# EAGLE design ChromDot_Ring_five_inch (EAGLE 9.1.0)
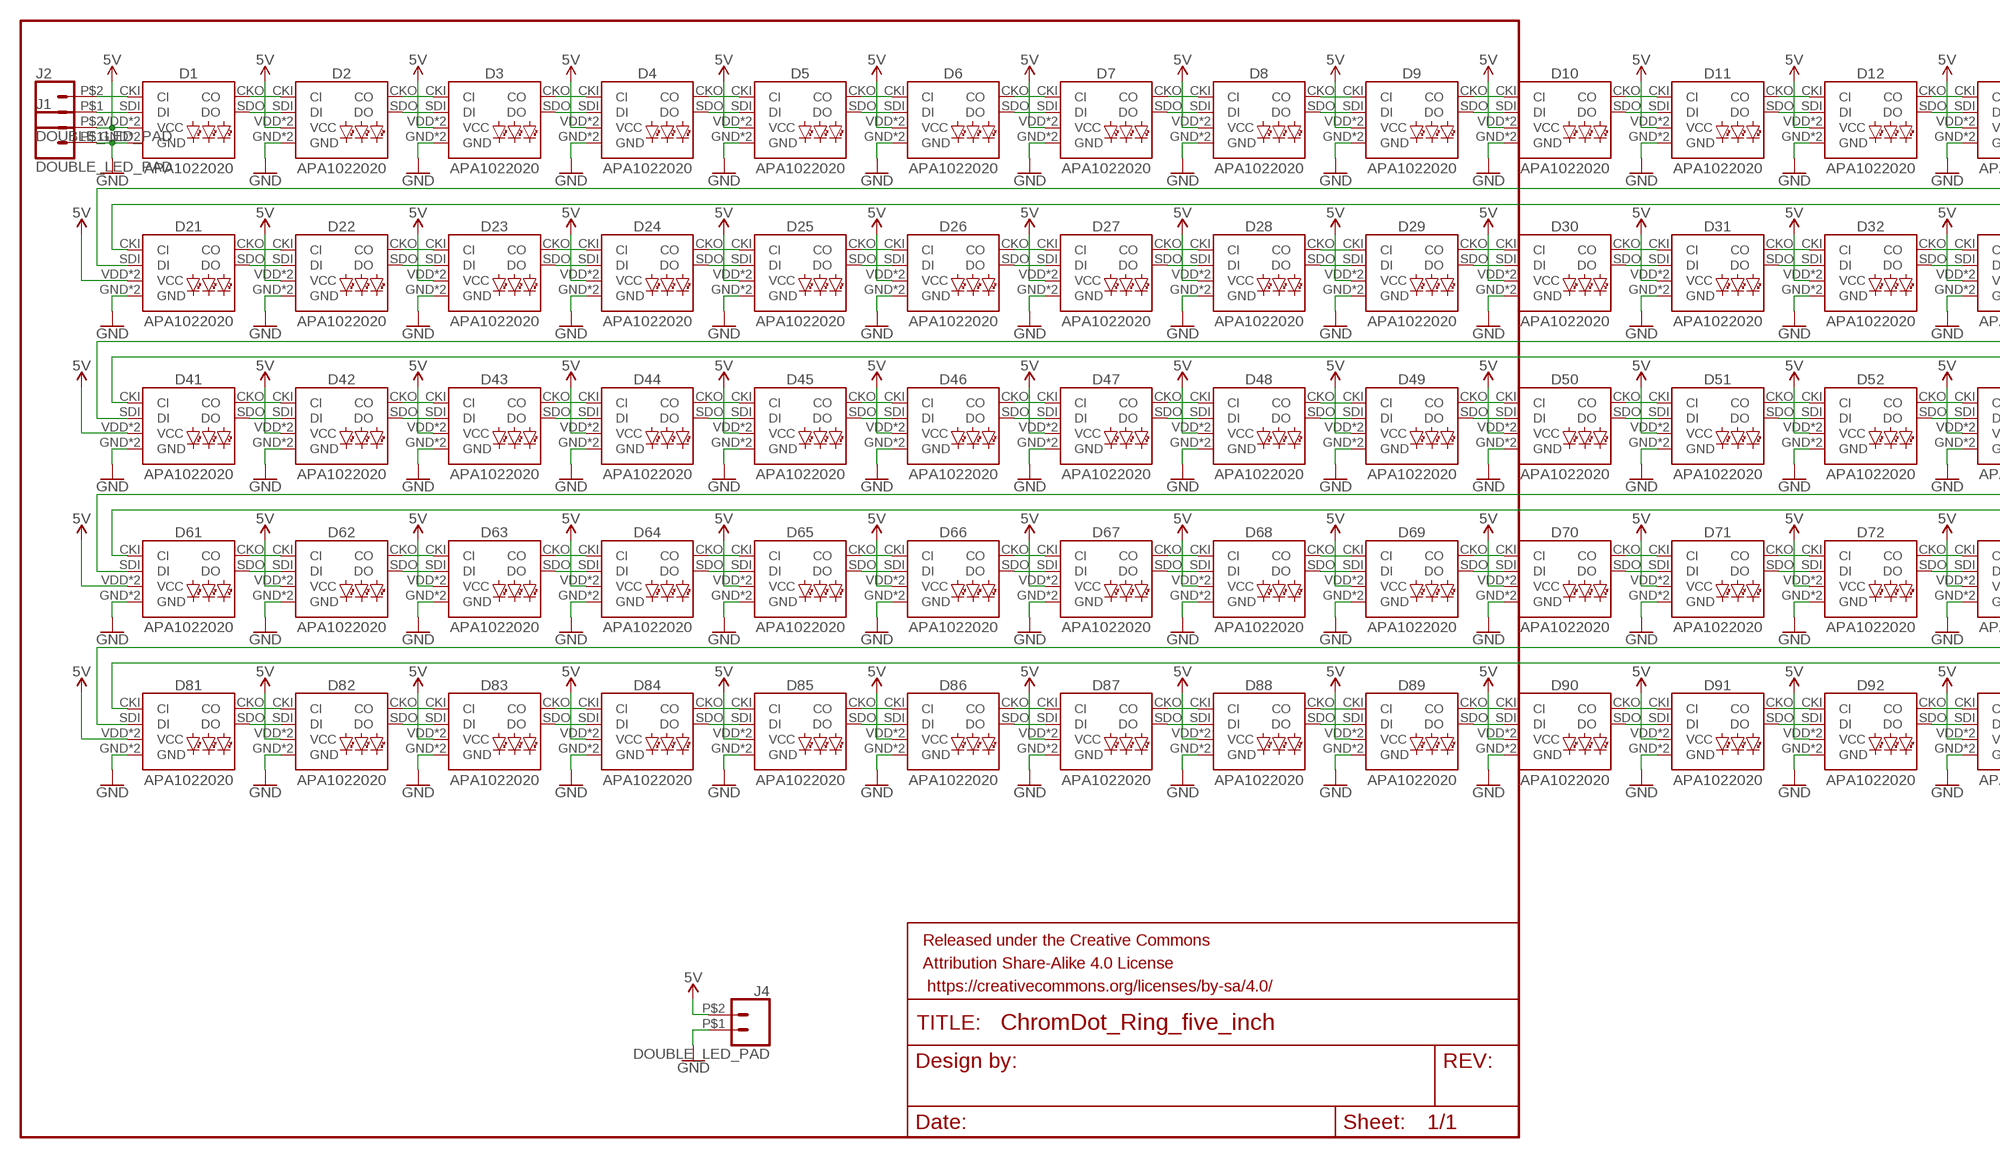
[diagram p0: schematic, sheet 1, part 1 of 2]
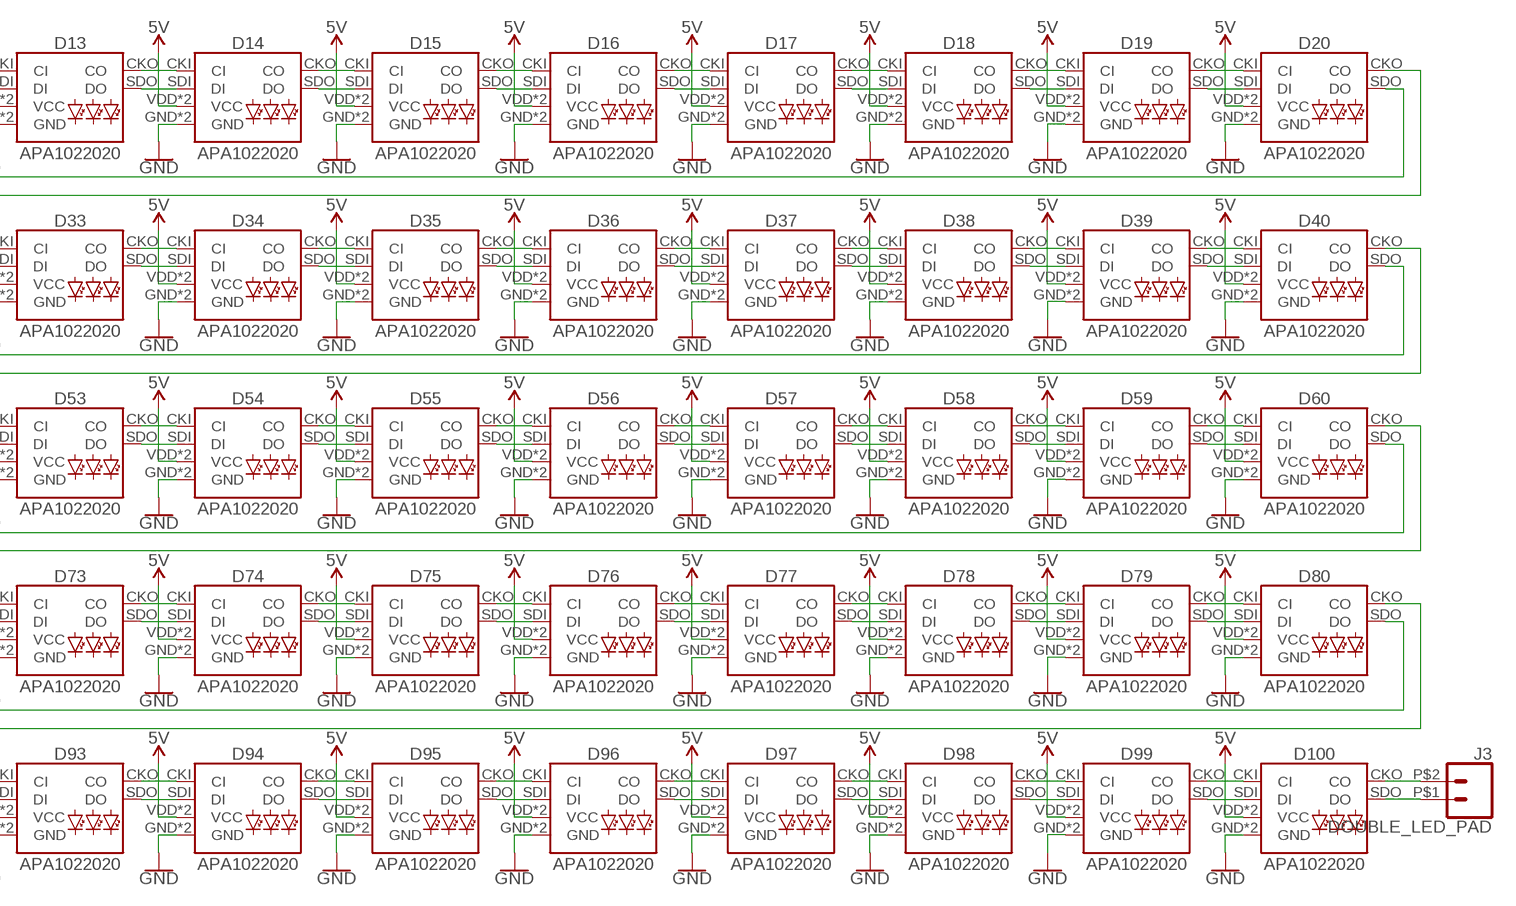
[diagram p1: schematic, sheet 1, part 2 of 2]

## Parts
D1  APA1022020  [APA102-2020]
D2  APA1022020  [APA102-2020]
D3  APA1022020  [APA102-2020]
D4  APA1022020  [APA102-2020]
D5  APA1022020  [APA102-2020]
D6  APA1022020  [APA102-2020]
D7  APA1022020  [APA102-2020]
D8  APA1022020  [APA102-2020]
D9  APA1022020  [APA102-2020]
D10  APA1022020  [APA102-2020]
D11  APA1022020  [APA102-2020]
D12  APA1022020  [APA102-2020]
D13  APA1022020  [APA102-2020]
D14  APA1022020  [APA102-2020]
D15  APA1022020  [APA102-2020]
D16  APA1022020  [APA102-2020]
D17  APA1022020  [APA102-2020]
D18  APA1022020  [APA102-2020]
D19  APA1022020  [APA102-2020]
D20  APA1022020  [APA102-2020]
D21  APA1022020  [APA102-2020]
D22  APA1022020  [APA102-2020]
D23  APA1022020  [APA102-2020]
D24  APA1022020  [APA102-2020]
D25  APA1022020  [APA102-2020]
D26  APA1022020  [APA102-2020]
D27  APA1022020  [APA102-2020]
D28  APA1022020  [APA102-2020]
D29  APA1022020  [APA102-2020]
D30  APA1022020  [APA102-2020]
D31  APA1022020  [APA102-2020]
D32  APA1022020  [APA102-2020]
D33  APA1022020  [APA102-2020]
D34  APA1022020  [APA102-2020]
D35  APA1022020  [APA102-2020]
D36  APA1022020  [APA102-2020]
D37  APA1022020  [APA102-2020]
D38  APA1022020  [APA102-2020]
D39  APA1022020  [APA102-2020]
D40  APA1022020  [APA102-2020]
D41  APA1022020  [APA102-2020]
D42  APA1022020  [APA102-2020]
D43  APA1022020  [APA102-2020]
D44  APA1022020  [APA102-2020]
D45  APA1022020  [APA102-2020]
D46  APA1022020  [APA102-2020]
D47  APA1022020  [APA102-2020]
D48  APA1022020  [APA102-2020]
D49  APA1022020  [APA102-2020]
D50  APA1022020  [APA102-2020]
D51  APA1022020  [APA102-2020]
D52  APA1022020  [APA102-2020]
D53  APA1022020  [APA102-2020]
D54  APA1022020  [APA102-2020]
D55  APA1022020  [APA102-2020]
D56  APA1022020  [APA102-2020]
D57  APA1022020  [APA102-2020]
D58  APA1022020  [APA102-2020]
D59  APA1022020  [APA102-2020]
D60  APA1022020  [APA102-2020]
D61  APA1022020  [APA102-2020]
D62  APA1022020  [APA102-2020]
D63  APA1022020  [APA102-2020]
D64  APA1022020  [APA102-2020]
D65  APA1022020  [APA102-2020]
D66  APA1022020  [APA102-2020]
D67  APA1022020  [APA102-2020]
D68  APA1022020  [APA102-2020]
D69  APA1022020  [APA102-2020]
D70  APA1022020  [APA102-2020]
D71  APA1022020  [APA102-2020]
D72  APA1022020  [APA102-2020]
D73  APA1022020  [APA102-2020]
D74  APA1022020  [APA102-2020]
D75  APA1022020  [APA102-2020]
D76  APA1022020  [APA102-2020]
D77  APA1022020  [APA102-2020]
D78  APA1022020  [APA102-2020]
D79  APA1022020  [APA102-2020]
D80  APA1022020  [APA102-2020]
D81  APA1022020  [APA102-2020]
D82  APA1022020  [APA102-2020]
D83  APA1022020  [APA102-2020]
D84  APA1022020  [APA102-2020]
D85  APA1022020  [APA102-2020]
D86  APA1022020  [APA102-2020]
D87  APA1022020  [APA102-2020]
D88  APA1022020  [APA102-2020]
D89  APA1022020  [APA102-2020]
D90  APA1022020  [APA102-2020]
D91  APA1022020  [APA102-2020]
D92  APA1022020  [APA102-2020]
D93  APA1022020  [APA102-2020]
D94  APA1022020  [APA102-2020]
D95  APA1022020  [APA102-2020]
D96  APA1022020  [APA102-2020]
D97  APA1022020  [APA102-2020]
D98  APA1022020  [APA102-2020]
D99  APA1022020  [APA102-2020]
D100  APA1022020  [APA102-2020]
FRAME1  FRAME-LETTER  [CREATIVE_COMMONS]
J1  DOUBLE_LED_PAD  [DOUBLELEDPAD]
J2  DOUBLE_LED_PAD  [DOUBLELEDPAD]
J3  DOUBLE_LED_PAD  [DOUBLELEDPAD]
J4  DOUBLE_LED_PAD  [DOUBLELEDPAD]

## Nets
5V: D1.VDD(VCC) D1.VDDPAD(VCC) D2.VDD(VCC) D2.VDDPAD(VCC) D3.VDD(VCC) D3.VDDPAD(VCC) D4.VDD(VCC) D4.VDDPAD(VCC) D5.VDD(VCC) D5.VDDPAD(VCC) D6.VDD(VCC) D6.VDDPAD(VCC) D7.VDD(VCC) D7.VDDPAD(VCC) D8.VDD(VCC) D8.VDDPAD(VCC) D9.VDD(VCC) D9.VDDPAD(VCC) D10.VDD(VCC) D10.VDDPAD(VCC) D11.VDD(VCC) D11.VDDPAD(VCC) D12.VDD(VCC) D12.VDDPAD(VCC) D13.VDD(VCC) D13.VDDPAD(VCC) D14.VDD(VCC) D14.VDDPAD(VCC) D15.VDD(VCC) D15.VDDPAD(VCC) D16.VDD(VCC) D16.VDDPAD(VCC) D17.VDD(VCC) D17.VDDPAD(VCC) D18.VDD(VCC) D18.VDDPAD(VCC) D19.VDD(VCC) D19.VDDPAD(VCC) D20.VDD(VCC) D20.VDDPAD(VCC) D21.VDD(VCC) D21.VDDPAD(VCC) D22.VDD(VCC) D22.VDDPAD(VCC) D23.VDD(VCC) D23.VDDPAD(VCC) D24.VDD(VCC) D24.VDDPAD(VCC) D25.VDD(VCC) D25.VDDPAD(VCC) D26.VDD(VCC) D26.VDDPAD(VCC) D27.VDD(VCC) D27.VDDPAD(VCC) D28.VDD(VCC) D28.VDDPAD(VCC) D29.VDD(VCC) D29.VDDPAD(VCC) D30.VDD(VCC) D30.VDDPAD(VCC) D31.VDD(VCC) D31.VDDPAD(VCC) D32.VDD(VCC) D32.VDDPAD(VCC) D33.VDD(VCC) D33.VDDPAD(VCC) D34.VDD(VCC) D34.VDDPAD(VCC) D35.VDD(VCC) D35.VDDPAD(VCC) D36.VDD(VCC) D36.VDDPAD(VCC) D37.VDD(VCC) D37.VDDPAD(VCC) D38.VDD(VCC) D38.VDDPAD(VCC) D39.VDD(VCC) D39.VDDPAD(VCC) D40.VDD(VCC) D40.VDDPAD(VCC) D41.VDD(VCC) D41.VDDPAD(VCC) D42.VDD(VCC) D42.VDDPAD(VCC) D43.VDD(VCC) D43.VDDPAD(VCC) D44.VDD(VCC) D44.VDDPAD(VCC) D45.VDD(VCC) D45.VDDPAD(VCC) D46.VDD(VCC) D46.VDDPAD(VCC) D47.VDD(VCC) D47.VDDPAD(VCC) D48.VDD(VCC) D48.VDDPAD(VCC) D49.VDD(VCC) D49.VDDPAD(VCC) D50.VDD(VCC) D50.VDDPAD(VCC) D51.VDD(VCC) D51.VDDPAD(VCC) D52.VDD(VCC) D52.VDDPAD(VCC) D53.VDD(VCC) D53.VDDPAD(VCC) D54.VDD(VCC) D54.VDDPAD(VCC) D55.VDD(VCC) D55.VDDPAD(VCC) D56.VDD(VCC) D56.VDDPAD(VCC) D57.VDD(VCC) D57.VDDPAD(VCC) D58.VDD(VCC) D58.VDDPAD(VCC) D59.VDD(VCC) D59.VDDPAD(VCC) D60.VDD(VCC) D60.VDDPAD(VCC) D61.VDD(VCC) D61.VDDPAD(VCC) D62.VDD(VCC) D62.VDDPAD(VCC) D63.VDD(VCC) D63.VDDPAD(VCC) D64.VDD(VCC) D64.VDDPAD(VCC) D65.VDD(VCC) D65.VDDPAD(VCC) D66.VDD(VCC) D66.VDDPAD(VCC) D67.VDD(VCC) D67.VDDPAD(VCC) D68.VDD(VCC) D68.VDDPAD(VCC) D69.VDD(VCC) D69.VDDPAD(VCC) D70.VDD(VCC) D70.VDDPAD(VCC) D71.VDD(VCC) D71.VDDPAD(VCC) D72.VDD(VCC) D72.VDDPAD(VCC) D73.VDD(VCC) D73.VDDPAD(VCC) D74.VDD(VCC) D74.VDDPAD(VCC) D75.VDD(VCC) D75.VDDPAD(VCC) D76.VDD(VCC) D76.VDDPAD(VCC) D77.VDD(VCC) D77.VDDPAD(VCC) D78.VDD(VCC) D78.VDDPAD(VCC) D79.VDD(VCC) D79.VDDPAD(VCC) D80.VDD(VCC) D80.VDDPAD(VCC) D81.VDD(VCC) D81.VDDPAD(VCC) D82.VDD(VCC) D82.VDDPAD(VCC) D83.VDD(VCC) D83.VDDPAD(VCC) D84.VDD(VCC) D84.VDDPAD(VCC) D85.VDD(VCC) D85.VDDPAD(VCC) D86.VDD(VCC) D86.VDDPAD(VCC) D87.VDD(VCC) D87.VDDPAD(VCC) D88.VDD(VCC) D88.VDDPAD(VCC) D89.VDD(VCC) D89.VDDPAD(VCC) D90.VDD(VCC) D90.VDDPAD(VCC) D91.VDD(VCC) D91.VDDPAD(VCC) D92.VDD(VCC) D92.VDDPAD(VCC) D93.VDD(VCC) D93.VDDPAD(VCC) D94.VDD(VCC) D94.VDDPAD(VCC) D95.VDD(VCC) D95.VDDPAD(VCC) D96.VDD(VCC) D96.VDDPAD(VCC) D97.VDD(VCC) D97.VDDPAD(VCC) D98.VDD(VCC) D98.VDDPAD(VCC) D99.VDD(VCC) D99.VDDPAD(VCC) D100.VDD(VCC) D100.VDDPAD(VCC) J1.P$2 J4.P$2
GND: D1.GND D1.GNDPAD(GND) D2.GND D2.GNDPAD(GND) D3.GND D3.GNDPAD(GND) D4.GND D4.GNDPAD(GND) D5.GND D5.GNDPAD(GND) D6.GND D6.GNDPAD(GND) D7.GND D7.GNDPAD(GND) D8.GND D8.GNDPAD(GND) D9.GND D9.GNDPAD(GND) D10.GND D10.GNDPAD(GND) D11.GND D11.GNDPAD(GND) D12.GND D12.GNDPAD(GND) D13.GND D13.GNDPAD(GND) D14.GND D14.GNDPAD(GND) D15.GND D15.GNDPAD(GND) D16.GND D16.GNDPAD(GND) D17.GND D17.GNDPAD(GND) D18.GND D18.GNDPAD(GND) D19.GND D19.GNDPAD(GND) D20.GND D20.GNDPAD(GND) D21.GND D21.GNDPAD(GND) D22.GND D22.GNDPAD(GND) D23.GND D23.GNDPAD(GND) D24.GND D24.GNDPAD(GND) D25.GND D25.GNDPAD(GND) D26.GND D26.GNDPAD(GND) D27.GND D27.GNDPAD(GND) D28.GND D28.GNDPAD(GND) D29.GND D29.GNDPAD(GND) D30.GND D30.GNDPAD(GND) D31.GND D31.GNDPAD(GND) D32.GND D32.GNDPAD(GND) D33.GND D33.GNDPAD(GND) D34.GND D34.GNDPAD(GND) D35.GND D35.GNDPAD(GND) D36.GND D36.GNDPAD(GND) D37.GND D37.GNDPAD(GND) D38.GND D38.GNDPAD(GND) D39.GND D39.GNDPAD(GND) D40.GND D40.GNDPAD(GND) D41.GND D41.GNDPAD(GND) D42.GND D42.GNDPAD(GND) D43.GND D43.GNDPAD(GND) D44.GND D44.GNDPAD(GND) D45.GND D45.GNDPAD(GND) D46.GND D46.GNDPAD(GND) D47.GND D47.GNDPAD(GND) D48.GND D48.GNDPAD(GND) D49.GND D49.GNDPAD(GND) D50.GND D50.GNDPAD(GND) D51.GND D51.GNDPAD(GND) D52.GND D52.GNDPAD(GND) D53.GND D53.GNDPAD(GND) D54.GND D54.GNDPAD(GND) D55.GND D55.GNDPAD(GND) D56.GND D56.GNDPAD(GND) D57.GND D57.GNDPAD(GND) D58.GND D58.GNDPAD(GND) D59.GND D59.GNDPAD(GND) D60.GND D60.GNDPAD(GND) D61.GND D61.GNDPAD(GND) D62.GND D62.GNDPAD(GND) D63.GND D63.GNDPAD(GND) D64.GND D64.GNDPAD(GND) D65.GND D65.GNDPAD(GND) D66.GND D66.GNDPAD(GND) D67.GND D67.GNDPAD(GND) D68.GND D68.GNDPAD(GND) D69.GND D69.GNDPAD(GND) D70.GND D70.GNDPAD(GND) D71.GND D71.GNDPAD(GND) D72.GND D72.GNDPAD(GND) D73.GND D73.GNDPAD(GND) D74.GND D74.GNDPAD(GND) D75.GND D75.GNDPAD(GND) D76.GND D76.GNDPAD(GND) D77.GND D77.GNDPAD(GND) D78.GND D78.GNDPAD(GND) D79.GND D79.GNDPAD(GND) D80.GND D80.GNDPAD(GND) D81.GND D81.GNDPAD(GND) D82.GND D82.GNDPAD(GND) D83.GND D83.GNDPAD(GND) D84.GND D84.GNDPAD(GND) D85.GND D85.GNDPAD(GND) D86.GND D86.GNDPAD(GND) D87.GND D87.GNDPAD(GND) D88.GND D88.GNDPAD(GND) D89.GND D89.GNDPAD(GND) D90.GND D90.GNDPAD(GND) D91.GND D91.GNDPAD(GND) D92.GND D92.GNDPAD(GND) D93.GND D93.GNDPAD(GND) D94.GND D94.GNDPAD(GND) D95.GND D95.GNDPAD(GND) D96.GND D96.GNDPAD(GND) D97.GND D97.GNDPAD(GND) D98.GND D98.GNDPAD(GND) D99.GND D99.GNDPAD(GND) D100.GND D100.GNDPAD(GND) J1.P$1 J4.P$1
N$1: D4.CKO(CO) D5.CKI(CI)
N$2: D1.CKI(CI) J2.P$2
N$3: D1.SDI(DI) J2.P$1
N$4: D1.CKO(CO) D2.CKI(CI)
N$5: D1.SDO(DO) D2.SDI(DI)
N$6: D2.CKO(CO) D3.CKI(CI)
N$7: D2.SDO(DO) D3.SDI(DI)
N$8: D3.CKO(CO) D4.CKI(CI)
N$9: D3.SDO(DO) D4.SDI(DI)
N$10: D4.SDO(DO) D5.SDI(DI)
N$11: D5.CKO(CO) D6.CKI(CI)
N$12: D5.SDO(DO) D6.SDI(DI)
N$13: D6.CKO(CO) D7.CKI(CI)
N$14: D6.SDO(DO) D7.SDI(DI)
N$15: D7.CKO(CO) D8.CKI(CI)
N$16: D7.SDO(DO) D8.SDI(DI)
N$17: D16.SDO(DO) D17.SDI(DI)
N$18: D80.CKO(CO) D81.CKI(CI)
N$19: D9.CKO(CO) D10.CKI(CI)
N$20: D9.SDO(DO) D10.SDI(DI)
N$21: D10.CKO(CO) D11.CKI(CI)
N$22: D10.SDO(DO) D11.SDI(DI)
N$23: D11.CKO(CO) D12.CKI(CI)
N$24: D11.SDO(DO) D12.SDI(DI)
N$25: D12.CKO(CO) D13.CKI(CI)
N$26: D12.SDO(DO) D13.SDI(DI)
N$27: D13.CKO(CO) D14.CKI(CI)
N$28: D13.SDO(DO) D14.SDI(DI)
N$29: D14.CKO(CO) D15.CKI(CI)
N$30: D14.SDO(DO) D15.SDI(DI)
N$31: D15.CKO(CO) D16.CKI(CI)
N$32: D15.SDO(DO) D16.SDI(DI)
N$33: D8.CKO(CO) D9.CKI(CI)
N$34: D8.SDO(DO) D9.SDI(DI)
N$35: D17.CKO(CO) D18.CKI(CI)
N$36: D17.SDO(DO) D18.SDI(DI)
N$37: D18.CKO(CO) D19.CKI(CI)
N$38: D18.SDO(DO) D19.SDI(DI)
N$39: D19.CKO(CO) D20.CKI(CI)
N$40: D19.SDO(DO) D20.SDI(DI)
N$41: D20.CKO(CO) D21.CKI(CI)
N$42: D20.SDO(DO) D21.SDI(DI)
N$43: D16.CKO(CO) D17.CKI(CI)
N$44: D21.CKO(CO) D22.CKI(CI)
N$45: D21.SDO(DO) D22.SDI(DI)
N$46: D22.CKO(CO) D23.CKI(CI)
N$47: D22.SDO(DO) D23.SDI(DI)
N$48: D23.CKO(CO) D24.CKI(CI)
N$49: D23.SDO(DO) D24.SDI(DI)
N$50: D24.CKO(CO) D25.CKI(CI)
N$51: D24.SDO(DO) D25.SDI(DI)
N$52: D25.CKO(CO) D26.CKI(CI)
N$53: D25.SDO(DO) D26.SDI(DI)
N$54: D26.CKO(CO) D27.CKI(CI)
N$55: D26.SDO(DO) D27.SDI(DI)
N$56: D27.CKO(CO) D28.CKI(CI)
N$57: D27.SDO(DO) D28.SDI(DI)
N$58: D29.CKO(CO) D30.CKI(CI)
N$59: D29.SDO(DO) D30.SDI(DI)
N$60: D30.CKO(CO) D31.CKI(CI)
N$61: D30.SDO(DO) D31.SDI(DI)
N$62: D31.CKO(CO) D32.CKI(CI)
N$63: D31.SDO(DO) D32.SDI(DI)
N$64: D32.CKO(CO) D33.CKI(CI)
N$65: D32.SDO(DO) D33.SDI(DI)
N$66: D33.CKO(CO) D34.CKI(CI)
N$67: D33.SDO(DO) D34.SDI(DI)
N$68: D34.CKO(CO) D35.CKI(CI)
N$69: D34.SDO(DO) D35.SDI(DI)
N$70: D35.CKO(CO) D36.CKI(CI)
N$71: D35.SDO(DO) D36.SDI(DI)
N$72: D37.CKO(CO) D38.CKI(CI)
N$73: D37.SDO(DO) D38.SDI(DI)
N$74: D38.SDO(DO) D39.SDI(DI)
N$75: D39.CKO(CO) D40.CKI(CI)
N$76: D39.SDO(DO) D40.SDI(DI)
N$77: D38.CKO(CO) D39.CKI(CI)
N$78: D28.CKO(CO) D29.CKI(CI)
N$79: D28.SDO(DO) D29.SDI(DI)
N$80: D36.SDO(DO) D37.SDI(DI)
N$81: D36.CKO(CO) D37.CKI(CI)
N$82: D40.CKO(CO) D41.CKI(CI)
N$83: D40.SDO(DO) D41.SDI(DI)
N$84: D41.CKO(CO) D42.CKI(CI)
N$85: D41.SDO(DO) D42.SDI(DI)
N$86: D42.CKO(CO) D43.CKI(CI)
N$87: D42.SDO(DO) D43.SDI(DI)
N$88: D43.CKO(CO) D44.CKI(CI)
N$89: D43.SDO(DO) D44.SDI(DI)
N$90: D44.CKO(CO) D45.CKI(CI)
N$91: D44.SDO(DO) D45.SDI(DI)
N$92: D45.CKO(CO) D46.CKI(CI)
N$93: D45.SDO(DO) D46.SDI(DI)
N$94: D46.CKO(CO) D47.CKI(CI)
N$95: D46.SDO(DO) D47.SDI(DI)
N$96: D47.CKO(CO) D48.CKI(CI)
N$97: D47.SDO(DO) D48.SDI(DI)
N$98: D49.CKO(CO) D50.CKI(CI)
N$99: D49.SDO(DO) D50.SDI(DI)
N$100: D50.CKO(CO) D51.CKI(CI)
N$101: D50.SDO(DO) D51.SDI(DI)
N$102: D51.CKO(CO) D52.CKI(CI)
N$103: D51.SDO(DO) D52.SDI(DI)
N$104: D52.CKO(CO) D53.CKI(CI)
N$105: D52.SDO(DO) D53.SDI(DI)
N$106: D53.CKO(CO) D54.CKI(CI)
N$107: D53.SDO(DO) D54.SDI(DI)
N$108: D54.CKO(CO) D55.CKI(CI)
N$109: D54.SDO(DO) D55.SDI(DI)
N$110: D55.CKO(CO) D56.CKI(CI)
N$111: D55.SDO(DO) D56.SDI(DI)
N$112: D57.CKO(CO) D58.CKI(CI)
N$113: D57.SDO(DO) D58.SDI(DI)
N$114: D58.SDO(DO) D59.SDI(DI)
N$115: D59.CKO(CO) D60.CKI(CI)
N$116: D59.SDO(DO) D60.SDI(DI)
N$117: D58.CKO(CO) D59.CKI(CI)
N$118: D48.CKO(CO) D49.CKI(CI)
N$119: D48.SDO(DO) D49.SDI(DI)
N$120: D56.SDO(DO) D57.SDI(DI)
N$121: D56.CKO(CO) D57.CKI(CI)
N$122: D60.CKO(CO) D61.CKI(CI)
N$123: D60.SDO(DO) D61.SDI(DI)
N$124: D61.CKO(CO) D62.CKI(CI)
N$125: D61.SDO(DO) D62.SDI(DI)
N$126: D62.CKO(CO) D63.CKI(CI)
N$127: D62.SDO(DO) D63.SDI(DI)
N$128: D63.CKO(CO) D64.CKI(CI)
N$129: D63.SDO(DO) D64.SDI(DI)
N$130: D64.CKO(CO) D65.CKI(CI)
N$131: D64.SDO(DO) D65.SDI(DI)
N$132: D65.CKO(CO) D66.CKI(CI)
N$133: D65.SDO(DO) D66.SDI(DI)
N$134: D66.CKO(CO) D67.CKI(CI)
N$135: D66.SDO(DO) D67.SDI(DI)
N$136: D67.CKO(CO) D68.CKI(CI)
N$137: D67.SDO(DO) D68.SDI(DI)
N$138: D69.CKO(CO) D70.CKI(CI)
N$139: D69.SDO(DO) D70.SDI(DI)
N$140: D70.CKO(CO) D71.CKI(CI)
N$141: D70.SDO(DO) D71.SDI(DI)
N$142: D71.CKO(CO) D72.CKI(CI)
N$143: D71.SDO(DO) D72.SDI(DI)
N$144: D72.CKO(CO) D73.CKI(CI)
N$145: D72.SDO(DO) D73.SDI(DI)
N$146: D73.CKO(CO) D74.CKI(CI)
N$147: D73.SDO(DO) D74.SDI(DI)
N$148: D74.CKO(CO) D75.CKI(CI)
N$149: D74.SDO(DO) D75.SDI(DI)
N$150: D75.CKO(CO) D76.CKI(CI)
N$151: D75.SDO(DO) D76.SDI(DI)
N$152: D77.CKO(CO) D78.CKI(CI)
N$153: D77.SDO(DO) D78.SDI(DI)
N$154: D78.SDO(DO) D79.SDI(DI)
N$155: D79.CKO(CO) D80.CKI(CI)
N$156: D79.SDO(DO) D80.SDI(DI)
N$157: D78.CKO(CO) D79.CKI(CI)
N$158: D68.CKO(CO) D69.CKI(CI)
N$159: D68.SDO(DO) D69.SDI(DI)
N$160: D76.SDO(DO) D77.SDI(DI)
N$161: D76.CKO(CO) D77.CKI(CI)
N$162: D100.SDO(DO) J3.P$1
N$163: D100.CKO(CO) J3.P$2
N$164: D80.SDO(DO) D81.SDI(DI)
N$165: D81.CKO(CO) D82.CKI(CI)
N$166: D81.SDO(DO) D82.SDI(DI)
N$167: D82.CKO(CO) D83.CKI(CI)
N$168: D82.SDO(DO) D83.SDI(DI)
N$169: D83.CKO(CO) D84.CKI(CI)
N$170: D83.SDO(DO) D84.SDI(DI)
N$171: D84.CKO(CO) D85.CKI(CI)
N$172: D84.SDO(DO) D85.SDI(DI)
N$173: D85.CKO(CO) D86.CKI(CI)
N$174: D85.SDO(DO) D86.SDI(DI)
N$175: D86.CKO(CO) D87.CKI(CI)
N$176: D86.SDO(DO) D87.SDI(DI)
N$177: D87.CKO(CO) D88.CKI(CI)
N$178: D87.SDO(DO) D88.SDI(DI)
N$179: D89.CKO(CO) D90.CKI(CI)
N$180: D89.SDO(DO) D90.SDI(DI)
N$181: D90.CKO(CO) D91.CKI(CI)
N$182: D90.SDO(DO) D91.SDI(DI)
N$183: D91.CKO(CO) D92.CKI(CI)
N$184: D91.SDO(DO) D92.SDI(DI)
N$185: D92.CKO(CO) D93.CKI(CI)
N$186: D92.SDO(DO) D93.SDI(DI)
N$187: D93.CKO(CO) D94.CKI(CI)
N$188: D93.SDO(DO) D94.SDI(DI)
N$189: D94.CKO(CO) D95.CKI(CI)
N$190: D94.SDO(DO) D95.SDI(DI)
N$191: D95.CKO(CO) D96.CKI(CI)
N$192: D95.SDO(DO) D96.SDI(DI)
N$193: D97.CKO(CO) D98.CKI(CI)
N$194: D97.SDO(DO) D98.SDI(DI)
N$195: D98.SDO(DO) D99.SDI(DI)
N$196: D99.CKO(CO) D100.CKI(CI)
N$197: D99.SDO(DO) D100.SDI(DI)
N$198: D98.CKO(CO) D99.CKI(CI)
N$199: D88.CKO(CO) D89.CKI(CI)
N$200: D88.SDO(DO) D89.SDI(DI)
N$201: D96.SDO(DO) D97.SDI(DI)
N$202: D96.CKO(CO) D97.CKI(CI)

## Library data of the parts
D1-D100 = SparkFun-LED:APA102: APA102 Addressable RGB LED Used in manufacturing of various products at SparkFun Packages: 5050 2020 SparkFun Products: SparkFun Lumenati Boards <https://www.sparkfun.com/categories/405>; PROD_ID: DIO-13883
FRAME1 = SparkFun-Aesthetics:FRAME-LETTER: Schematic Frame - Letter Standard 8.5x11 US Letter frame
J1-J4 = Andy:DOUBLE_LED_PAD

## Board
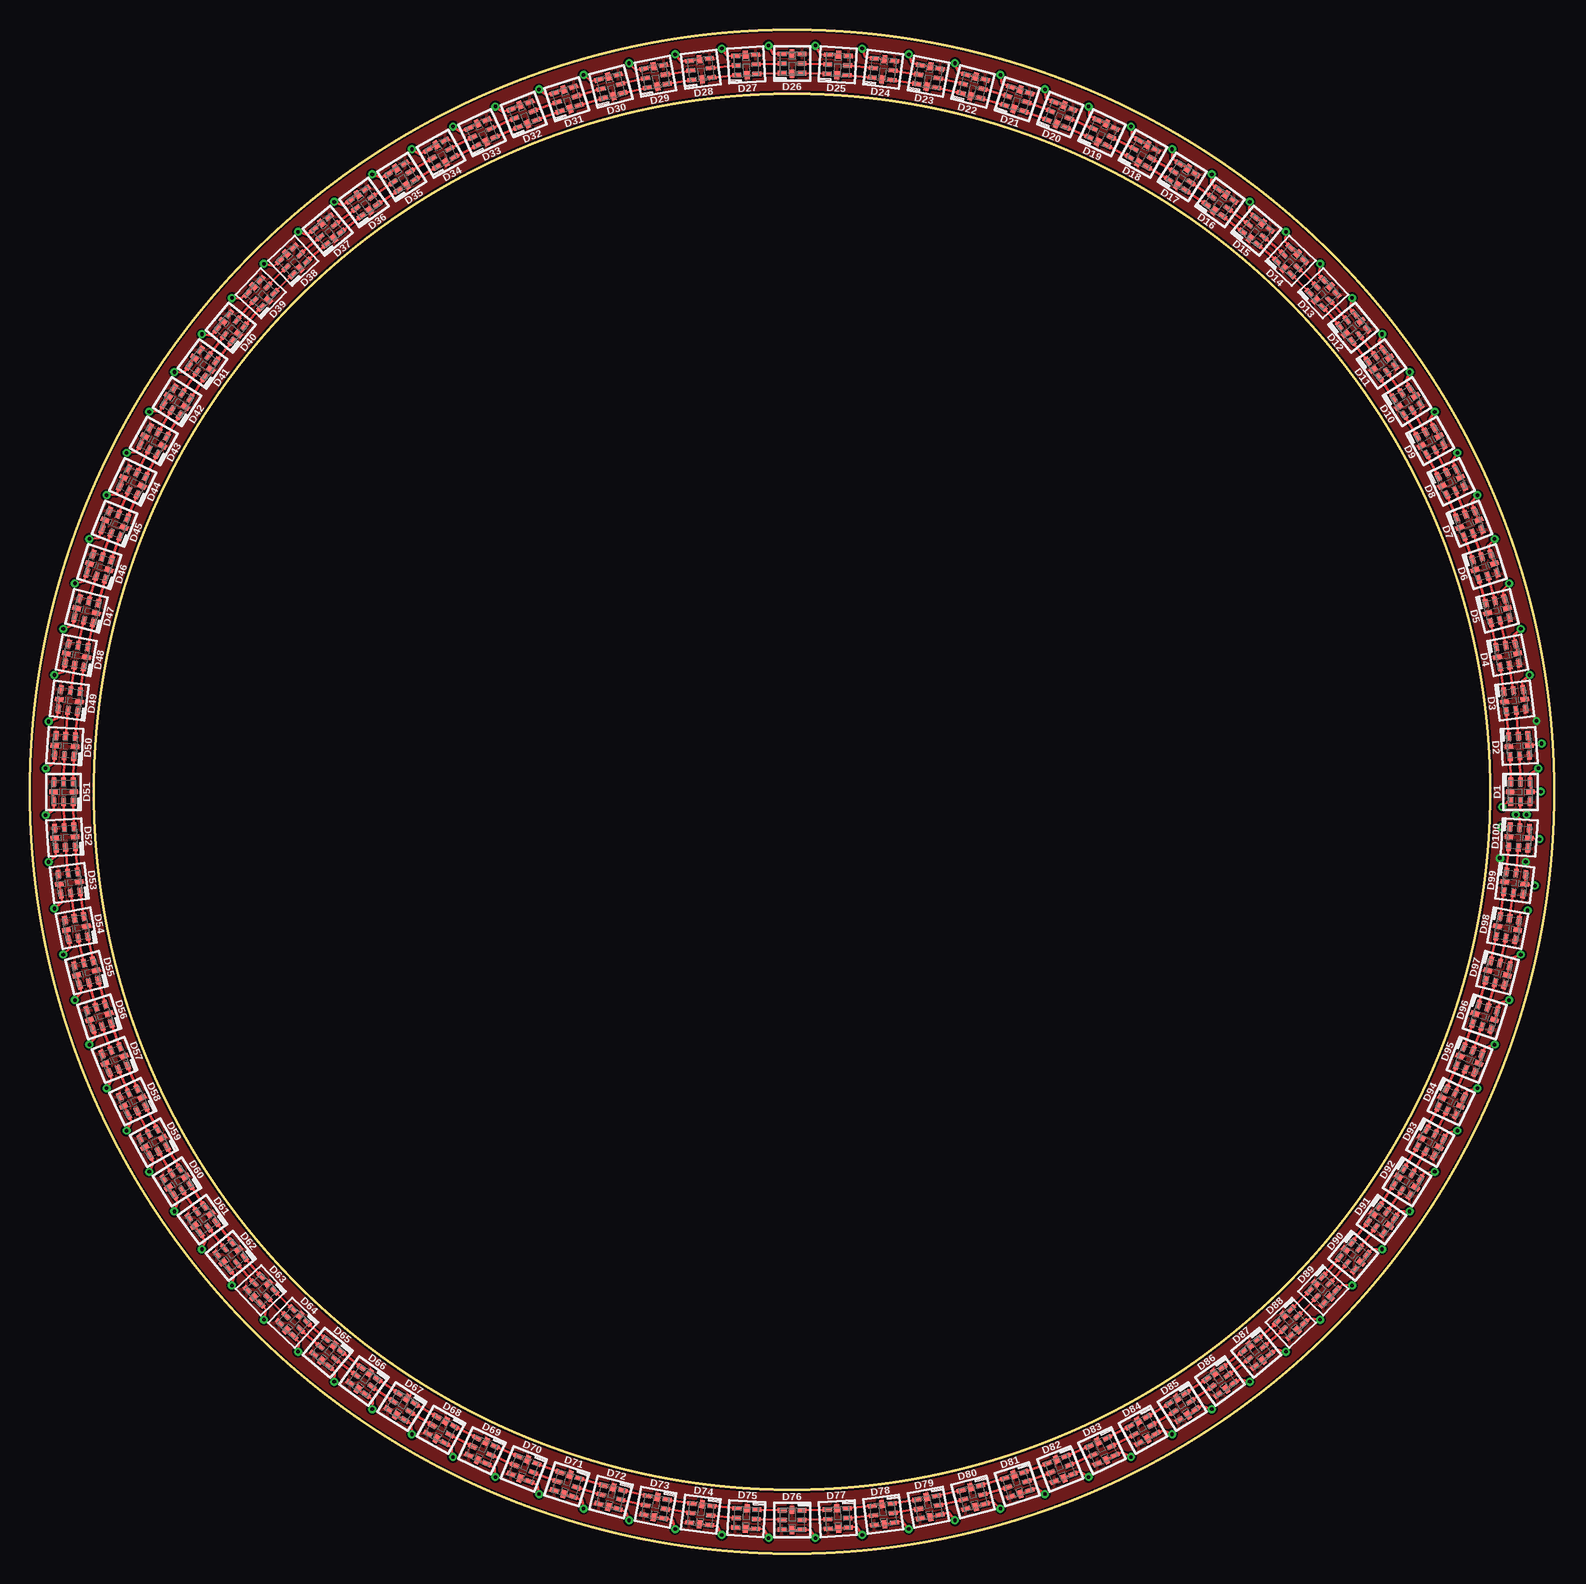
[diagram p2: board, top side]
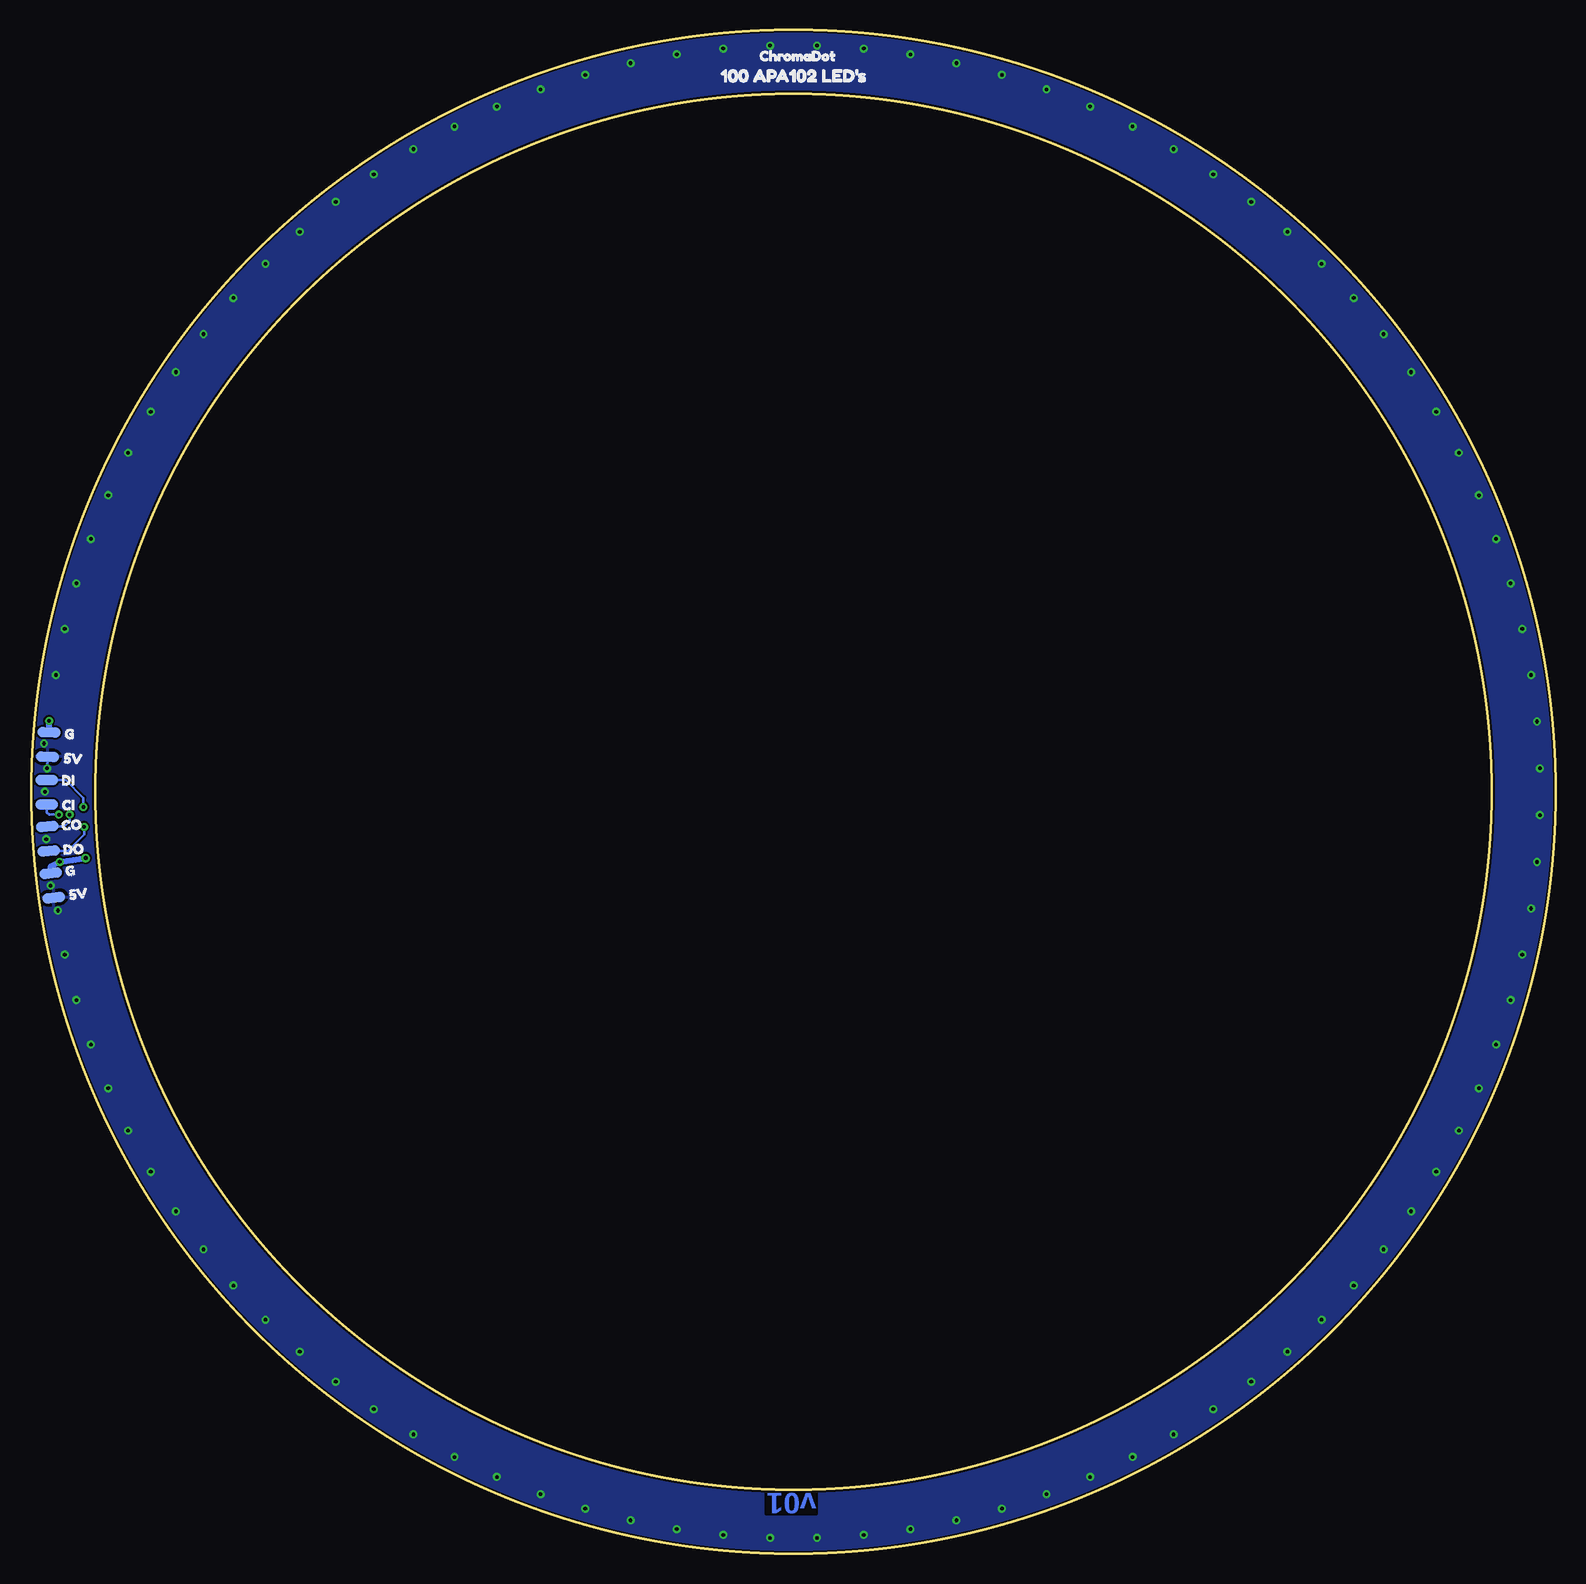
[diagram p3: board, bottom side, seen from below]

Size 127 x 127 mm. Coordinates in mm from the lower left corner, seen from the top.
Outline: circle at 63.5,63.5 radius 63.5
Outline: circle at 63.5,63.5 radius 58.17
Copper layers (1*16): Top 0.035mm / dielectric 1.5mm / Bottom 0.035mm
Design rules "SparkFun-2-layer-PCBWay-LIMIT": minimum track width 6mil, minimum drill 0.3mm, track to track 6mil, track to pad 6mil, pad to pad 6mil, via to via 6mil, smd to smd 6mil, copper to edge 6mil, drill to drill 6mil, minimum pad ring 7mil, minimum via ring 7mil, stop-mask expansion 4mil, vias tented up to drill 25mil, thermal gap 10mil

### Footprints (pad centres in the part's own frame; a part is rotated, then mirrored left to right if it is on the bottom)
APA102-2020 = smd 0.7 x 0.4: CKI -0.85,0; CKO 0.85,0; GND -0.85,-0.8; SDI -0.85,0.8; SDO 0.85,0.8; VDD 0.85,-0.8 | smd 0.4 x 0.7: GNDPAD 0,0.85; VDDPAD 0,-0.85
DOUBLELEDPAD = smd 0.889 x 1.905: P$1 -1.016,0; P$2 1.016,0

### Placement (x,y rotation side)
D1  124.21,63.5 90 top
D2  124.09,67.31 93.6 top
D3  123.73,71.11 97.2 top
D4  123.13,74.87 100.8 top
D5  122.3,78.6 104.4 top
D6  121.23,82.26 108 top
D7  119.94,85.85 111.6 top
D8  118.43,89.35 115.2 top
D9  116.7,92.75 118.8 top
D10  114.75,96.03 122.4 top
D11  112.61,99.18 126 top
D12  110.27,102.19 129.6 top
D13  107.75,105.06 133.2 top
D14  105.06,107.75 136.8 top
D15  102.19,110.27 140.4 top
D16  99.18,112.61 144 top
D17  96.03,114.75 147.6 top
D18  92.75,116.7 151.2 top
D19  89.35,118.43 154.8 top
D20  85.85,119.94 158.4 top
D21  82.26,121.23 162 top
D22  78.6,122.3 165.6 top
D23  74.87,123.13 169.2 top
D24  71.11,123.73 172.8 top
D25  67.31,124.09 176.4 top
D26  63.5,124.21 180 top
D27  59.69,124.09 183.6 top
D28  55.89,123.73 187.2 top
D29  52.13,123.13 190.8 top
D30  48.4,122.3 194.4 top
D31  44.74,121.23 198 top
D32  41.15,119.94 201.6 top
D33  37.65,118.43 205.2 top
D34  34.25,116.7 208.8 top
D35  30.97,114.75 212.4 top
D36  27.82,112.61 216 top
D37  24.81,110.27 219.6 top
D38  21.94,107.75 223.2 top
D39  19.25,105.06 226.8 top
D40  16.73,102.19 230.4 top
D41  14.39,99.18 234 top
D42  12.25,96.03 237.6 top
D43  10.3,92.75 241.2 top
D44  8.57,89.35 244.8 top
D45  7.06,85.85 248.4 top
D46  5.77,82.26 252 top
D47  4.7,78.6 255.6 top
D48  3.87,74.87 259.2 top
D49  3.27,71.11 262.8 top
D50  2.91,67.31 266.4 top
D51  2.79,63.5 270 top
D52  2.91,59.69 273.6 top
D53  3.27,55.89 277.2 top
D54  3.87,52.13 280.8 top
D55  4.7,48.4 284.4 top
D56  5.77,44.74 288 top
D57  7.06,41.15 291.6 top
D58  8.57,37.65 295.2 top
D59  10.3,34.25 298.8 top
D60  12.25,30.97 302.4 top
D61  14.39,27.82 306 top
D62  16.73,24.81 309.6 top
D63  19.25,21.94 313.2 top
D64  21.94,19.25 316.8 top
D65  24.81,16.73 320.4 top
D66  27.82,14.39 324 top
D67  30.97,12.25 327.6 top
D68  34.25,10.3 331.2 top
D69  37.65,8.57 334.8 top
D70  41.15,7.06 338.4 top
D71  44.74,5.77 342 top
D72  48.4,4.7 345.6 top
D73  52.13,3.87 349.2 top
D74  55.89,3.27 352.8 top
D75  59.69,2.91 356.4 top
D76  63.5,2.79 0 top
D77  67.31,2.91 3.6 top
D78  71.11,3.27 7.2 top
D79  74.87,3.87 10.8 top
D80  78.6,4.7 14.4 top
D81  82.26,5.77 18 top
D82  85.85,7.06 21.6 top
D83  89.35,8.57 25.2 top
D84  92.75,10.3 28.8 top
D85  96.03,12.25 32.4 top
D86  99.18,14.39 36 top
D87  102.19,16.73 39.6 top
D88  105.06,19.25 43.2 top
D89  107.75,21.94 46.8 top
D90  110.27,24.81 50.4 top
D91  112.61,27.82 54 top
D92  114.75,30.97 57.6 top
D93  116.7,34.25 61.2 top
D94  118.43,37.65 64.8 top
D95  119.94,41.15 68.4 top
D96  121.23,44.74 72 top
D97  122.3,48.4 75.6 top
D98  123.13,52.13 79.2 top
D99  123.73,55.89 82.8 top
D100  124.09,59.69 86.4 top
FRAME1  38.59,-9.21 0 top  (outside the outline)
J1  125.6,67.44 266.4 bottom
J2  125.73,63.45 270 bottom
J3  125.62,59.58 93.6 bottom
J4  125.26,55.69 277.2 bottom
U$1  [CHROMADOT5]  67.06,124.84 0 bottom
U$3  [5V6]  124.59,54.8 7.2 bottom
U$4  [5V6]  125.03,66.36 356.4 bottom
U$5  [G4]  124.97,68.39 356.4 bottom
U$6  [G4]  124.9,56.77 7.2 bottom
U$7  [DO3]  125.09,58.61 3.6 bottom
U$8  [CO1]  125.22,60.64 3.6 bottom
U$9  [CI6]  125.2,62.4 0 bottom
U$10  [DI4]  125.22,64.45 0 bottom
U$11  [100_APA102_LED#S0]  70.48,123.19 0 bottom

### Tracks (layer width: path | path; a pad name or v marks a point on that pad's centre or on a via)
5V  (via drill 0.3)
  Top 0.203: v125.89,63.51 D1.VDDPAD D1.VDD 125.03,64.96 v125.7,65.45 | D2.VDD D2.VDDPAD v125.96,67.52 | v125.77,59.55 D100.VDDPAD D100.VDD | D99.VDD D99.VDDPAD v125.41,55.67 | D3.VDDPAD D3.VDD 124.33,72.71 v124.96,73.23 | D4.VDDPAD D4.VDD 123.64,76.58 v124.23,77.08 | D5.VDDPAD D5.VDD 122.75,80.33 v123.26,80.86 | D6.VDDPAD D6.VDD 121.54,84.01 v122.05,84.58 | D7.VDDPAD D7.VDD 120.14,87.63 v120.61,88.22 | D8.VDDPAD D8.VDD 118.56,91.12 v118.95,91.75 | D9.VDDPAD D9.VDD 116.65,94.55 v117.06,95.18 | D10.VDDPAD D10.VDD 114.68,97.79 v114.97,98.48 | D11.VDDPAD D11.VDD 112.39,101.03 v112.67,101.64 | D12.VDDPAD D12.VDD 109.98,103.82 v110.18,104.65 | D13.VDDPAD D13.VDD 107.38,106.62 v107.5,107.5 | D14.VDDPAD D14.VDD 104.59,109.35 v104.65,110.18 | D15.VDDPAD D15.VDD 101.6,111.89 v101.64,112.67 | D16.VDDPAD D16.VDD 98.42,114.17 v98.48,114.97 | D17.VDDPAD D17.VDD 95.19,116.33 v95.18,117.06 | D18.VDDPAD D18.VDD 91.82,118.24 v91.75,118.95 | D19.VDDPAD D19.VDD 88.27,119.89 v88.22,120.61 | D20.VDDPAD D20.VDD 84.64,121.35 v84.58,122.05 | D21.VDDPAD D21.VDD 80.96,122.56 v80.86,123.26 | D22.VDDPAD D22.VDD 77.34,123.51 v77.08,124.23 | D23.VDDPAD D23.VDD 73.47,124.27 v73.23,124.96 | D24.VDDPAD D24.VDD 69.6,124.78 v69.36,125.45 | D25.VDDPAD D25.VDD 65.85,124.97 v65.45,125.7 | D26.VDDPAD D26.VDD 61.91,125.03 v61.55,125.7 | D27.VDDPAD D27.VDD 58.1,124.84 v57.64,125.45 | D28.VDDPAD D28.VDD 54.23,124.4 v53.77,124.96 | D29.VDDPAD D29.VDD 50.42,123.7 v49.93,124.23 | D30.VDDPAD D30.VDD 46.74,122.75 v46.14,123.26 | D31.VDDPAD D31.VDD 42.99,121.6 v42.42,122.05 | D32.VDDPAD D32.VDD 39.37,120.2 v38.79,120.61 | D33.VDDPAD D33.VDD 35.81,118.56 v35.25,118.95
  Top 0.203: D34.VDDPAD D34.VDD 32.45,116.65 v31.82,117.06 | D35.VDDPAD D35.VDD 29.27,114.68 v28.52,114.97 | D36.VDDPAD D36.VDD 26.04,112.39 v25.36,112.67 | D37.VDDPAD D37.VDD 23.05,109.92 v22.35,110.18 | D38.VDDPAD D38.VDD 20.32,107.31 v19.5,107.5 | D39.VDDPAD D39.VDD 17.53,104.59 v16.82,104.65 | D40.VDDPAD D40.VDD 15.11,101.54 v14.33,101.64 | D41.VDDPAD D41.VDD 12.83,98.42 v12.03,98.48 | D42.VDDPAD D42.VDD 10.8,95.25 v9.94,95.18 | D43.VDDPAD D43.VDD 8.83,91.82 v8.05,91.75 | D44.VDDPAD D44.VDD 7.18,88.27 v6.39,88.22 | D45.VDDPAD D45.VDD 5.72,84.64 v4.95,84.58 | D46.VDDPAD D46.VDD 4.45,81.03 v3.74,80.86 | D47.VDDPAD D47.VDD 3.56,77.41 v2.77,77.08 | D48.VDDPAD D48.VDD 2.73,73.47 v2.04,73.23 | D49.VDDPAD D49.VDD 2.22,69.6 v1.55,69.36 | D50.VDDPAD D50.VDD 1.97,65.91 v1.3,65.45 | D51.VDDPAD D51.VDD 1.97,61.98 v1.3,61.55 | D52.VDDPAD D52.VDD 2.16,58.17 v1.55,57.64 | D53.VDDPAD D53.VDD 2.67,54.29 v2.04,53.77 | D54.VDDPAD D54.VDD 3.37,50.48 v2.77,49.93 | D55.VDDPAD D55.VDD 4.25,46.8 v3.74,46.14 | D56.VDDPAD D56.VDD 5.46,43.05 v4.95,42.42 | D57.VDDPAD D57.VDD 6.79,39.5 v6.39,38.79 | D58.VDDPAD D58.VDD 8.45,36 v8.05,35.25 | D59.VDDPAD D59.VDD 10.29,32.58 v9.94,31.82 | D60.VDDPAD D60.VDD 12.32,29.27 v12.03,28.52 | D61.VDDPAD D61.VDD 14.61,26.04 v14.33,25.36 | D62.VDDPAD D62.VDD 17.02,23.18 v16.82,22.35 | D63.VDDPAD D63.VDD 19.69,20.32 v19.5,19.5 | D64.VDDPAD D64.VDD 22.42,17.65 v22.35,16.82 | D65.VDDPAD D65.VDD 25.4,15.18 v25.36,14.33 | D66.VDDPAD D66.VDD 28.58,12.83 v28.52,12.03 | D67.VDDPAD D67.VDD 31.75,10.8 v31.82,9.94 | D68.VDDPAD D68.VDD 35.12,8.89 v35.25,8.05 | D69.VDDPAD D69.VDD 38.73,7.11 v38.79,6.39
  Top 0.203: D70.VDDPAD D70.VDD 42.29,5.72 v42.42,4.95 | D71.VDDPAD D71.VDD 46.04,4.45 v46.14,3.74 | D72.VDDPAD D72.VDD 49.66,3.49 v49.93,2.77 | D73.VDDPAD D73.VDD 53.53,2.79 v53.77,2.04 | D74.VDDPAD D74.VDD 57.28,2.29 v57.64,1.55 | D75.VDDPAD D75.VDD 61.15,2.03 v61.55,1.3 | D76.VDDPAD D76.VDD 65.02,1.97 v65.45,1.3 | D77.VDDPAD D77.VDD 68.9,2.22 v69.36,1.55 | D78.VDDPAD D78.VDD 72.71,2.67 v73.23,2.04 | D79.VDDPAD D79.VDD 76.58,3.43 v77.08,2.77 | D80.VDDPAD D80.VDD 80.26,4.32 v80.86,3.74 | D81.VDDPAD D81.VDD 83.88,5.46 v84.58,4.95 | D82.VDDPAD D82.VDD 87.44,6.86 v88.22,6.39 | D83.VDDPAD D83.VDD 91,8.45 v91.75,8.05 | D84.VDDPAD D84.VDD 94.42,10.29 v95.18,9.94 | D85.VDDPAD D85.VDD 97.66,12.32 v98.48,12.03 | D86.VDDPAD D86.VDD 100.84,14.54 v101.64,14.33 | D87.VDDPAD D87.VDD 103.89,17.02 v104.65,16.82 | D88.VDDPAD D88.VDD 106.68,19.62 v107.5,19.5 | D89.VDDPAD D89.VDD 109.35,22.42 v110.18,22.35 | D90.VDDPAD D90.VDD 111.82,25.34 v112.67,25.36 | D91.VDDPAD D91.VDD 114.11,28.51 v114.97,28.52 | D92.VDDPAD D92.VDD 116.2,31.75 v117.06,31.82 | D93.VDDPAD D93.VDD 118.17,35.12 v118.95,35.25 | D94.VDDPAD D94.VDD 119.76,38.61 v120.61,38.79 | D95.VDDPAD D95.VDD 121.22,42.16 v122.05,42.42 | D96.VDDPAD D96.VDD 122.49,45.91 v123.26,46.14 | D97.VDDPAD D97.VDD 123.51,49.66 v124.23,49.93 | D98.VDDPAD D98.VDD 124.21,53.34 v124.8,53.61
  Bottom 0.203: v125.7,65.45 J1.P$2
  pour Bottom: 0,63.5 arc-90 63.5,127 arc-270
GND  (via drill 0.3, 0.35)
  Top 0.152: D67.GNDPAD 31.75,13.29 31.75,13.34
  Bottom 0.508: v125.54,69.41 J1.P$1 | J4.P$1 125.39,57.27 v124.65,57.66 v122.49,57.98
  pour Top: 127,63.5 arc90 63.5,127 arc270
N$1
  Top 0.203: D5.CKI D4.CKO
N$2  (via drill 0.3)
  Top 0.203: D1.CKI 124.21,62.1 v124.71,61.59
  Bottom 0.203: J2.P$2 125.73,61.79 125.54,61.59 v124.71,61.59
N$3  (via drill 0.3)
  Top 0.203: D1.SDI 123.1,62.65 v122.68,62.23
  Bottom 0.203: v122.68,62.23 122.68,62.99 124.16,64.47 124.46,64.47 | 124.46,64.47 J2.P$1 | 124.46,64.47
N$4
  Top 0.203: D2.CKI D1.CKO
N$5
  Top 0.203: D2.SDI D1.SDO
N$6
  Top 0.203: D2.CKO D3.CKI
N$7
  Top 0.203: D3.SDI D2.SDO
N$8
  Top 0.203: D3.CKO D4.CKI
N$9
  Top 0.203: D4.SDI D3.SDO
N$10
  Top 0.203: D5.SDI D4.SDO
N$11
  Top 0.203: D6.CKI D5.CKO
N$12
  Top 0.203: D6.SDI D5.SDO
N$13
  Top 0.203: D6.CKO D7.CKI
N$14
  Top 0.203: D7.SDI D6.SDO
N$15
  Top 0.203: D8.CKI D7.CKO
N$16
  Top 0.203: D7.SDO D8.SDI
N$17
  Top 0.203: D17.SDI D16.SDO
N$18
  Top 0.203: D81.CKI D80.CKO
N$19
  Top 0.203: D10.CKI D9.CKO
N$20
  Top 0.203: D9.SDO D10.SDI
N$21
  Top 0.203: D10.CKO D11.CKI
N$22
  Top 0.203: D11.SDI D10.SDO
N$23
  Top 0.203: D12.CKI D11.CKO
N$24
  Top 0.203: D11.SDO D12.SDI
N$25
  Top 0.203: D13.CKI D12.CKO
N$26
  Top 0.203: D13.SDI D12.SDO
N$27
  Top 0.203: D14.CKI D13.CKO
N$28
  Top 0.203: D14.SDI D13.SDO
N$29
  Top 0.203: D15.CKI D14.CKO
N$30
  Top 0.203: D14.SDO D15.SDI
N$31
  Top 0.203: D15.CKO D16.CKI
N$32
  Top 0.203: D15.SDO D16.SDI
N$33
  Top 0.203: D8.CKO D9.CKI
N$34
  Top 0.203: D9.SDI D8.SDO
N$35
  Top 0.203: D17.CKO D18.CKI
N$36
  Top 0.203: D18.SDI D17.SDO
N$37
  Top 0.203: D18.CKO D19.CKI
N$38
  Top 0.203: D19.SDI D18.SDO
N$39
  Top 0.203: D19.CKO D20.CKI
N$40
  Top 0.203: D20.SDI D19.SDO
N$41
  Top 0.203: D20.CKO D21.CKI
N$42
  Top 0.203: D21.SDI D20.SDO
N$43
  Top 0.203: D16.CKO D17.CKI
N$44
  Top 0.203: D21.CKO D22.CKI
N$45
  Top 0.203: D22.SDI D21.SDO
N$46
  Top 0.203: D22.CKO D23.CKI
N$47
  Top 0.203: D23.SDI D22.SDO
N$48
  Top 0.203: D23.CKO D24.CKI
N$49
  Top 0.203: D24.SDI D23.SDO
N$50
  Top 0.203: D24.CKO D25.CKI
N$51
  Top 0.203: D25.SDI D24.SDO
N$52
  Top 0.203: D25.CKO D26.CKI
N$53
  Top 0.203: D26.SDI D25.SDO
N$54
  Top 0.203: D26.CKO D27.CKI
N$55
  Top 0.203: D27.SDI D26.SDO
N$56
  Top 0.203: D27.CKO D28.CKI
N$57
  Top 0.203: D28.SDI D27.SDO
N$58
  Top 0.203: D29.CKO D30.CKI
N$59
  Top 0.203: D30.SDI D29.SDO
N$60
  Top 0.203: D30.CKO D31.CKI
N$61
  Top 0.203: D31.SDI D30.SDO
N$62
  Top 0.203: D31.CKO D32.CKI
N$63
  Top 0.203: D32.SDI D31.SDO
N$64
  Top 0.203: D32.CKO D33.CKI
N$65
  Top 0.203: D33.SDI D32.SDO
N$66
  Top 0.203: D33.CKO D34.CKI
N$67
  Top 0.203: D34.SDI D33.SDO
N$68
  Top 0.203: D35.CKI D34.CKO
N$69
  Top 0.203: D34.SDO D35.SDI
N$70
  Top 0.203: D36.CKI D35.CKO
N$71
  Top 0.203: D35.SDO D36.SDI
N$72
  Top 0.203: D37.CKO D38.CKI
N$73
  Top 0.203: D38.SDI D37.SDO
N$74
  Top 0.203: D39.SDI D38.SDO
N$75
  Top 0.203: D40.CKI D39.CKO
N$76
  Top 0.203: D39.SDO D40.SDI
N$77
  Top 0.203: D38.CKO D39.CKI
N$78
  Top 0.203: D28.CKO D29.CKI
N$79
  Top 0.203: D29.SDI D28.SDO
N$80
  Top 0.203: D36.SDO D37.SDI
N$81
  Top 0.203: D37.CKI D36.CKO
N$82
  Top 0.203: D41.CKI D40.CKO
N$83
  Top 0.203: D40.SDO D41.SDI
N$84
  Top 0.203: D42.CKI D41.CKO
N$85
  Top 0.203: D41.SDO D42.SDI
N$86
  Top 0.203: D42.CKO D43.CKI
N$87
  Top 0.203: D43.SDI D42.SDO
N$88
  Top 0.203: D43.CKO D44.CKI
N$89
  Top 0.203: D43.SDO D44.SDI
N$90
  Top 0.203: D44.CKO D45.CKI
N$91
  Top 0.203: D45.SDI D44.SDO
N$92
  Top 0.203: D45.CKO D46.CKI
N$93
  Top 0.203: D45.SDO D46.SDI
N$94
  Top 0.203: D46.CKO D47.CKI
N$95
  Top 0.203: D46.SDO D47.SDI
N$96
  Top 0.203: D47.CKO D48.CKI
N$97
  Top 0.203: D48.SDI D47.SDO
N$98
  Top 0.203: D49.CKO D50.CKI
N$99
  Top 0.203: D50.SDI D49.SDO
N$100
  Top 0.203: D50.CKO D51.CKI
N$101
  Top 0.203: D50.SDO D51.SDI
N$102
  Top 0.203: D51.CKO D52.CKI
N$103
  Top 0.203: D51.SDO D52.SDI
N$104
  Top 0.203: D52.CKO D53.CKI
N$105
  Top 0.203: D52.SDO D53.SDI
N$106
  Top 0.203: D53.CKO D54.CKI
N$107
  Top 0.203: D53.SDO D54.SDI
N$108
  Top 0.203: D54.CKO D55.CKI
N$109
  Top 0.203: D54.SDO D55.SDI
N$110
  Top 0.203: D55.CKO D56.CKI
N$111
  Top 0.203: D55.SDO D56.SDI
N$112
  Top 0.203: D57.CKO D58.CKI
N$113
  Top 0.203: D57.SDO D58.SDI
N$114
  Top 0.203: D58.SDO D59.SDI
N$115
  Top 0.203: D59.CKO D60.CKI
N$116
  Top 0.203: D59.SDO D60.SDI
N$117
  Top 0.203: D58.CKO D59.CKI
N$118
  Top 0.203: D48.CKO D49.CKI
N$119
  Top 0.203: D48.SDO D49.SDI
N$120
  Top 0.203: D56.SDO D57.SDI
N$121
  Top 0.203: D56.CKO D57.CKI
N$122
  Top 0.203: D60.CKO D61.CKI
N$123
  Top 0.203: D60.SDO D61.SDI
N$124
  Top 0.203: D61.CKO D62.CKI
N$125
  Top 0.203: D62.SDI D61.SDO
N$126
  Top 0.203: D62.CKO D63.CKI
N$127
  Top 0.203: D62.SDO D63.SDI
N$128
  Top 0.203: D64.CKI D63.CKO
N$129
  Top 0.203: D63.SDO D64.SDI
N$130
  Top 0.203: D65.CKI D64.CKO
N$131
  Top 0.203: D64.SDO D65.SDI
N$132
  Top 0.203: D66.CKI D65.CKO
N$133
  Top 0.203: D65.SDO D66.SDI
N$134
  Top 0.203: D66.CKO D67.CKI
N$135
  Top 0.203: D67.SDI D66.SDO
N$136
  Top 0.203: D68.CKI D67.CKO
N$137
  Top 0.203: D67.SDO D68.SDI
N$138
  Top 0.203: D70.CKI D69.CKO
N$139
  Top 0.203: D69.SDO D70.SDI
N$140
  Top 0.203: D70.CKO D71.CKI
N$141
  Top 0.203: D71.SDI D70.SDO
N$142
  Top 0.203: D72.CKI D71.CKO
N$143
  Top 0.203: D71.SDO D72.SDI
N$144
  Top 0.203: D72.CKO D73.CKI
N$145
  Top 0.203: D73.SDI D72.SDO
N$146
  Top 0.203: D74.CKI D73.CKO
N$147
  Top 0.203: D73.SDO D74.SDI
N$148
  Top 0.203: D74.CKO D75.CKI
N$149
  Top 0.203: D75.SDI D74.SDO
N$150
  Top 0.203: D76.CKI D75.CKO
N$151
  Top 0.203: D75.SDO D76.SDI
N$152
  Top 0.203: D77.CKO D78.CKI
N$153
  Top 0.203: D77.SDO D78.SDI
N$154
  Top 0.203: D79.SDI D78.SDO
N$155
  Top 0.203: D79.CKO D80.CKI
N$156
  Top 0.203: D79.SDO D80.SDI
N$157
  Top 0.203: D78.CKO D79.CKI
N$158
  Top 0.203: D69.CKI D68.CKO
N$159
  Top 0.203: D68.SDO D69.SDI
N$160
  Top 0.203: D77.SDI D76.SDO
N$161
  Top 0.203: D76.CKO D77.CKI
N$162  (via drill 0.3)
  Top 0.203: v122.62,60.58 122.63,60.59 D100.SDO
  Bottom 0.203: v122.62,60.58 122.62,59.94 124,58.57 J3.P$1
N$163  (via drill 0.3)
  Top 0.203: D100.CKO 124.14,61.28 v123.83,61.59
  Bottom 0.203: v123.83,61.59 123.83,61.02 124.25,60.59 J3.P$2
N$164
  Top 0.203: D80.SDO D81.SDI
N$165
  Top 0.203: D81.CKO D82.CKI
N$166
  Top 0.203: D82.SDI D81.SDO
N$167
  Top 0.203: D82.CKO D83.CKI
N$168
  Top 0.203: D82.SDO D83.SDI
N$169
  Top 0.203: D84.CKI D83.CKO
N$170
  Top 0.203: D83.SDO D84.SDI
N$171
  Top 0.203: D85.CKI D84.CKO
N$172
  Top 0.203: D84.SDO D85.SDI
N$173
  Top 0.203: D85.CKO D86.CKI
N$174
  Top 0.203: D85.SDO D86.SDI
N$175
  Top 0.203: D87.CKI D86.CKO
N$176
  Top 0.203: D86.SDO D87.SDI
N$177
  Top 0.203: D87.CKO D88.CKI
N$178
  Top 0.203: D87.SDO D88.SDI
N$179
  Top 0.203: D89.CKO D90.CKI
N$180
  Top 0.203: D89.SDO D90.SDI
N$181
  Top 0.203: D90.CKO D91.CKI
N$182
  Top 0.203: D91.SDI D90.SDO
N$183
  Top 0.203: D92.CKI D91.CKO
N$184
  Top 0.203: D91.SDO D92.SDI
N$185
  Top 0.203: D93.CKI D92.CKO
N$186
  Top 0.203: D92.SDO D93.SDI
N$187
  Top 0.203: D94.CKI D93.CKO
N$188
  Top 0.203: D94.SDI D93.SDO
N$189
  Top 0.203: D95.CKI D94.CKO
N$190
  Top 0.203: D95.SDI D94.SDO
N$191
  Top 0.203: D95.CKO D96.CKI
N$192
  Top 0.203: D96.SDI D95.SDO
N$193
  Top 0.203: D98.CKI D97.CKO
N$194
  Top 0.203: D98.SDI D97.SDO
N$195
  Top 0.203: D99.SDI D98.SDO
N$196
  Top 0.203: D99.CKO D100.CKI
N$197
  Top 0.203: D99.SDO D100.SDI
N$198
  Top 0.203: D99.CKI D98.CKO
N$199
  Top 0.203: D88.CKO D89.CKI
N$200
  Top 0.203: D89.SDI D88.SDO
N$201
  Top 0.203: D97.SDI D96.SDO
N$202
  Top 0.203: D96.CKO D97.CKI

### Text on the board
Bottom: v01